# Altium schematic sheet Tube.SchDoc
size B; Organization: Altium Limited; Address1: L3, 12a Rodborough Rd; Address2: Frenchs Forest; Address3: NSW; Address4: Australia 2086
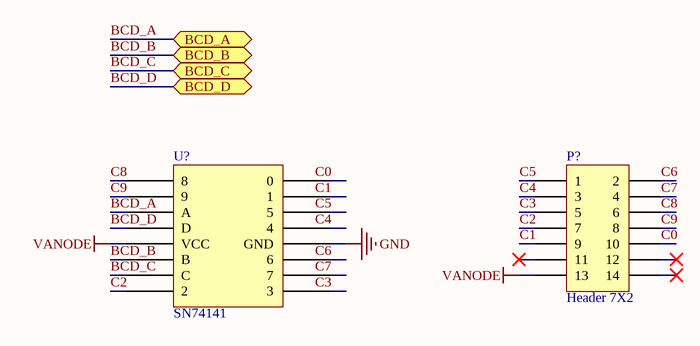
[diagram p0: Tube.SchDoc]

## Parts
P?  Header 7X2  [HDR2X7]
U?  SN74141  [DIP-16]

## Ports
BCD_A, BCD_B, BCD_C, BCD_D

## Nets
GND: U?.12(GND)
VANODE: P?.13 U?.5(VCC)
BCD_A: U?.3(A) ; port BCD_A
BCD_B: U?.6(B) ; port BCD_B
BCD_C: U?.7(C) ; port BCD_C
BCD_D: U?.4(D) ; port BCD_D
C0: P?.10
C1: P?.9
C2: P?.7 U?.8(2)
C3: P?.5
C4: P?.3
C5: P?.1
C6: P?.2
C7: P?.4
C8: P?.6 U?.1(8)
C9: P?.8 U?.2(9)

Not connected (* = marked no-connect by the designer): P? 11* 12* 14*; U? 9(3) 10(7) 11(6) 13(4) 14(5) 15(1) 16(0)

## Notes on the sheet
- Labels drawn without touching a wire or pin: C0, C1, C3, C4, C5, C6, C7
- Title
- Size:
- Date:
- B
- Number:
- Time:
- Revision:
- Sheet
- of
- File:

## Library data of the parts
P? = Header 7X2: Header, 7-Pin, Dual row; LatestRevisionDate: 17-Jul-2002; LatestRevisionNote: Re-released for DXP Platform.; Publisher: Altium Limited
U? = BCD-to-Decimal Driver: PartNumber: SN74141